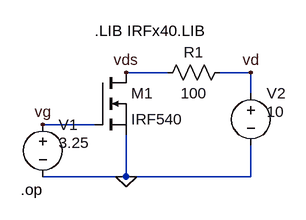
[diagram p0: schematic Draft3.asc]
Draft3.asc, the LTspice schematic file:
Version 4
SHEET 1 880 680
WIRE 304 80 240 80
WIRE 432 80 384 80
WIRE 432 112 432 80
WIRE 192 160 112 160
WIRE 240 240 240 176
WIRE 240 240 112 240
WIRE 432 240 432 192
WIRE 432 240 240 240
FLAG 240 240 0
FLAG 240 80 vds
FLAG 112 160 vg
FLAG 432 80 vd
SYMBOL voltage 112 144 R0
WINDOW 3 24 44 Left 2
WINDOW 123 0 0 Left 0
WINDOW 39 0 0 Left 0
SYMATTR InstName V1
SYMATTR Value 3.25
SYMBOL nmos 192 80 R0
SYMATTR InstName M1
SYMATTR Value IRF540
SYMBOL res 400 64 R90
WINDOW 0 0 56 VBottom 2
WINDOW 3 32 56 VTop 2
SYMATTR InstName R1
SYMATTR Value 100
SYMBOL voltage 432 96 R0
WINDOW 3 24 44 Left 2
WINDOW 123 0 0 Left 0
WINDOW 39 0 0 Left 0
SYMATTR InstName V2
SYMATTR Value 10
TEXT 192 16 Left 2 !.LIB IRFx40.LIB
TEXT 78 260 Left 2 !.op

The netlist it stands for:
* Draft3.asc
V1 vg 0 3.25
M1 vds vg 0 0 IRF540
R1 vd vds 100
V2 vd 0 10
.model NMOS NMOS
.model PMOS PMOS
.lib standard.mos
.LIB IRFx40.LIB
.op
.backanno
.end